# EAGLE schematic EDCPSU_M2 v1 (EAGLE 9.6.2)
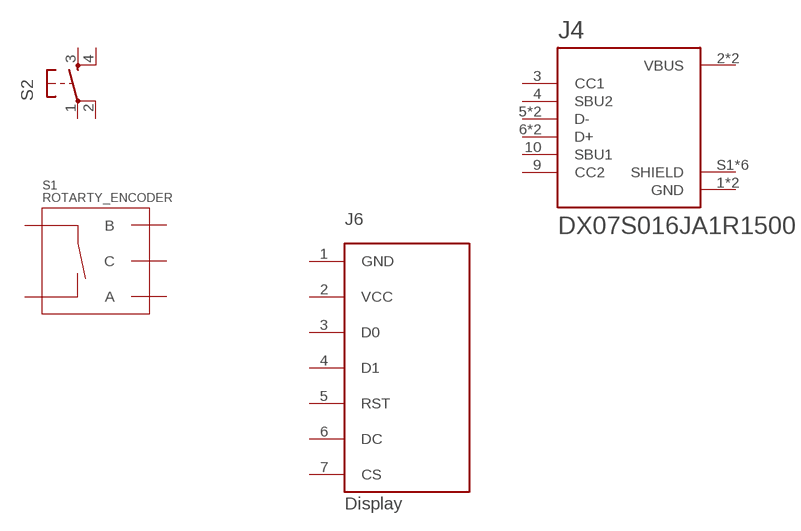
[diagram p0: schematic, sheet 1, part 1 of 2]
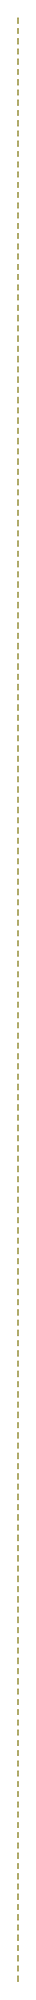
[diagram p1: schematic, sheet 1, part 2 of 2]

## Parts
J4  DX07S016JA1R1500  [JAE_DX07S016JA1R1500]
J6  Display  OLED_LCD  [OLED_LCD]
S1  ROTARTY_ENCODER  [ROTARY_ENC_PLAIN]
S2  TAC_SWITCH_KSC931G-SMD  [TAC_SW_SMD_KSC931G]
Unconnected: J4.3(CC1) J4.4(SBU2) J4.5(D-) J4.6(D+) J4.7(D+) J4.8(D-) J4.9(CC2) J4.10(SBU1) J4.S1(SHIELD) J4.S2(SHIELD) J4.S3(SHIELD) J4.S4(SHIELD) J4.S5(SHIELD) J4.S6(SHIELD) J6.1(GND) J6.2(VCC) J6.3(D0) J6.4(D1) J6.5(RST) J6.6(DC) J6.7(CS) S1.A S1.B S1.C S1.SW+ S1.SW- S2.1 S2.2 S2.3 S2.4

## Power pins joined to a net without a drawn wire
GND: J4.1(GND) J4.12(GND)
VBUS: J4.2(VBUS) J4.11(VBUS)

## Library data of the parts
J4 = DX07S016JA1R1500:DX07S016JA1R1500: USB-C (USB TYPE-C) USB 2.0 Receptacle Connector 24 (16+8 Dummy) Position Surface Mount, Right Angle; Through Hole; DESCRIPTION: USB-C (USB TYPE-C) USB 2.0 Receptacle Connector 24 (16+8 Dummy) Position Surface Mount, Right Angle; Through Hole; DIGI-KEY_PART_NUMBER: 670-DX07S016JA1R1500CT-ND; MF: JAE Electronics; MP: DX07S016JA1R1500; PACKAGE: None; PURCHASE-URL: https://pricing.snapeda.com/search/part/DX07S016JA1R1500/?ref=eda
J6 = EDCPSU:OLED_LCD
S1 = SparkFun-Electromechanical:ROTARTY_ENCODER: Simple no LED rotary encoder Example: COM-09117
S2 = EDCPSU - Rev2:TAC_SWITCH: Momentary Switch Button commonly used for reset or general input. Spark Fun Electronics SKU : COM-00097 SMT- SWCH-08247

## Net classes
1 vcc: width 0.254 mm